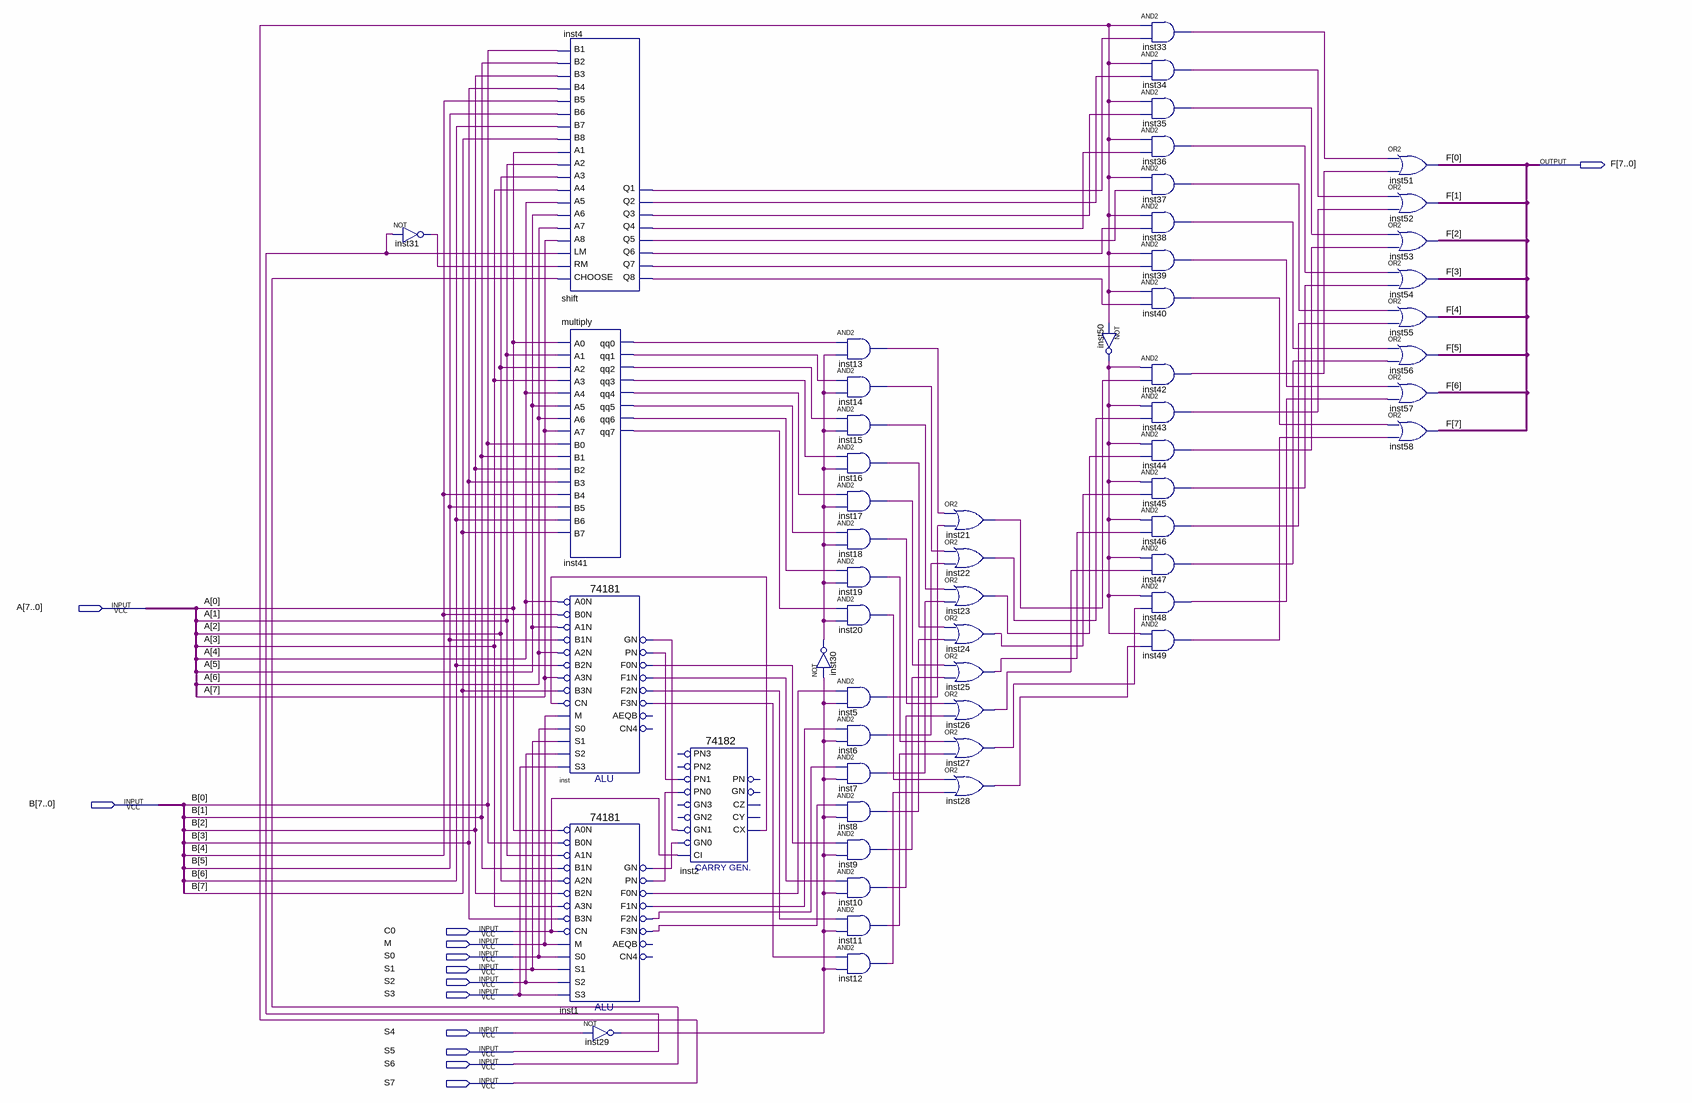
[diagram p0: schematic sheet]
// Quartus schematic ALU.bdf as structural Verilog: 57 symbols, 13 pins
module ALU (
  input  [7:0] A,
  input  [7:0] B,
  input  C0,
  input  M,
  input  S0,
  input  S1,
  input  S2,
  input  S3,
  input  S4,
  input  S5,
  input  S6,
  input  S7,
  output [7:0] F
);

  wire inst1_f0n, inst1_f1n, inst1_f2n, inst1_f3n, inst1_gn, inst1_pn, inst2_cx, inst4_q1, inst4_q2,
       inst4_q3, inst4_q4, inst4_q5, inst4_q6, inst4_q7, inst4_q8, inst5_out, inst6_out, inst7_out,
       inst8_out, inst9_out, inst10_out, inst11_out, inst12_out, inst13_out, inst14_out, inst15_out,
       inst16_out, inst17_out, inst18_out, inst19_out, inst20_out, inst21_out, inst22_out, inst23_out,
       inst24_out, inst25_out, inst26_out, inst27_out, inst28_out, inst29_out, inst30_out, inst31_out,
       inst33_out, inst34_out, inst35_out, inst36_out, inst37_out, inst38_out, inst39_out, inst40_out,
       inst41_qq0, inst41_qq1, inst41_qq2, inst41_qq3, inst41_qq4, inst41_qq5, inst41_qq6, inst41_qq7,
       inst42_out, inst43_out, inst44_out, inst45_out, inst46_out, inst47_out, inst48_out, inst49_out,
       inst50_out, inst_f0n, inst_f1n, inst_f2n, inst_f3n, inst_gn, inst_pn;

  not inst31 (inst31_out, S5);
  shift inst4 (
    .CHOOSE(S6), .RM(inst31_out), .LM(S5), .A8(A[7]), .A7(A[6]), .A6(A[5]), .A5(A[4]), .A4(A[3]), .A3(A[2]),
    .A2(A[1]), .A1(A[0]), .B8(B[7]), .B7(B[6]), .B6(B[5]), .B5(B[4]), .B4(B[3]), .B3(B[2]), .B2(B[1]),
    .B1(B[0]), .Q8(inst4_q8), .Q7(inst4_q7), .Q6(inst4_q6), .Q5(inst4_q5), .Q4(inst4_q4), .Q3(inst4_q3),
    .Q2(inst4_q2), .Q1(inst4_q1));
  multiply inst41 (
    .A7(A[7]), .A6(A[6]), .A5(A[5]), .A4(A[4]), .A3(A[3]), .A2(A[2]), .A1(A[1]), .A0(A[0]), .B0(B[0]),
    .B1(B[1]), .B2(B[2]), .B3(B[3]), .B4(B[4]), .B5(B[5]), .B6(B[6]), .B7(B[7]), .qq7(inst41_qq7),
    .qq6(inst41_qq6), .qq5(inst41_qq5), .qq4(inst41_qq4), .qq3(inst41_qq3), .qq2(inst41_qq2),
    .qq1(inst41_qq1), .qq0(inst41_qq0));
  \74181  inst (
    .B0N(B[4]), .A0N(A[4]), .A1N(A[5]), .B1N(B[5]), .A3N(A[7]), .B2N(B[6]), .A2N(A[6]), .M(M), .CN(inst2_cx),
    .B3N(B[7]), .S2(S2), .S1(S1), .S0(S0), .S3(S3), .PN(inst_pn), .GN(inst_gn), .F3N(inst_f3n),
    .F1N(inst_f1n), .F0N(inst_f0n), .F2N(inst_f2n));  // open: AEQB, CN4
  \74181  inst1 (
    .B0N(B[0]), .A0N(A[0]), .A1N(A[1]), .B1N(B[1]), .A3N(A[3]), .B2N(B[2]), .A2N(A[2]), .M(M), .CN(C0),
    .B3N(B[3]), .S2(S2), .S1(S1), .S0(S0), .S3(S3), .PN(inst1_pn), .GN(inst1_gn), .F3N(inst1_f3n),
    .F1N(inst1_f1n), .F0N(inst1_f0n), .F2N(inst1_f2n));  // open: AEQB, CN4
  not inst29 (inst29_out, S4);
  \74182  inst2 (
    .CI(C0), .PN1(inst_pn), .PN0(inst1_pn), .GN1(inst_gn), .GN0(inst1_gn), .CX(inst2_cx));  // open: PN2, GN2, GN3, PN3, CY, PN, CZ, GN
  and inst13 (inst13_out, inst41_qq0, inst30_out);
  and inst14 (inst14_out, inst41_qq1, inst30_out);
  and inst15 (inst15_out, inst41_qq2, inst30_out);
  and inst16 (inst16_out, inst41_qq3, inst30_out);
  and inst17 (inst17_out, inst41_qq4, inst30_out);
  and inst18 (inst18_out, inst41_qq5, inst30_out);
  and inst19 (inst19_out, inst41_qq6, inst30_out);
  and inst20 (inst20_out, inst41_qq7, inst30_out);
  not inst30 (inst30_out, inst29_out);
  and inst5 (inst5_out, inst1_f0n, inst29_out);
  and inst6 (inst6_out, inst1_f1n, inst29_out);
  and inst7 (inst7_out, inst1_f2n, inst29_out);
  and inst8 (inst8_out, inst1_f3n, inst29_out);
  and inst9 (inst9_out, inst_f0n, inst29_out);
  and inst10 (inst10_out, inst_f1n, inst29_out);
  and inst11 (inst11_out, inst_f2n, inst29_out);
  and inst12 (inst12_out, inst_f3n, inst29_out);
  or inst21 (inst21_out, inst13_out, inst5_out);
  or inst22 (inst22_out, inst14_out, inst6_out);
  or inst23 (inst23_out, inst15_out, inst7_out);
  or inst24 (inst24_out, inst16_out, inst8_out);
  or inst25 (inst25_out, inst17_out, inst9_out);
  or inst26 (inst26_out, inst18_out, inst10_out);
  or inst27 (inst27_out, inst19_out, inst11_out);
  or inst28 (inst28_out, inst20_out, inst12_out);
  not inst50 (inst50_out, S7);
  and inst33 (inst33_out, S7, inst4_q1);
  and inst34 (inst34_out, S7, inst4_q2);
  and inst35 (inst35_out, S7, inst4_q3);
  and inst36 (inst36_out, S7, inst4_q4);
  and inst37 (inst37_out, S7, inst4_q5);
  and inst38 (inst38_out, S7, inst4_q6);
  and inst39 (inst39_out, S7, inst4_q7);
  and inst40 (inst40_out, S7, inst4_q8);
  and inst42 (inst42_out, inst50_out, inst21_out);
  and inst43 (inst43_out, inst50_out, inst22_out);
  and inst44 (inst44_out, inst50_out, inst23_out);
  and inst45 (inst45_out, inst50_out, inst24_out);
  and inst46 (inst46_out, inst50_out, inst25_out);
  and inst47 (inst47_out, inst50_out, inst26_out);
  and inst48 (inst48_out, inst50_out, inst27_out);
  and inst49 (inst49_out, inst50_out, inst28_out);
  or inst51 (F[0], inst33_out, inst42_out);
  or inst52 (F[1], inst34_out, inst43_out);
  or inst53 (F[2], inst35_out, inst44_out);
  or inst54 (F[3], inst36_out, inst45_out);
  or inst55 (F[4], inst37_out, inst46_out);
  or inst56 (F[5], inst38_out, inst47_out);
  or inst57 (F[6], inst39_out, inst48_out);
  or inst58 (F[7], inst40_out, inst49_out);
endmodule
